# EAGLE schematic preparedinstruments_0_bechemel_v12 #MOTHERBOARD (EAGLE 9.6.2)
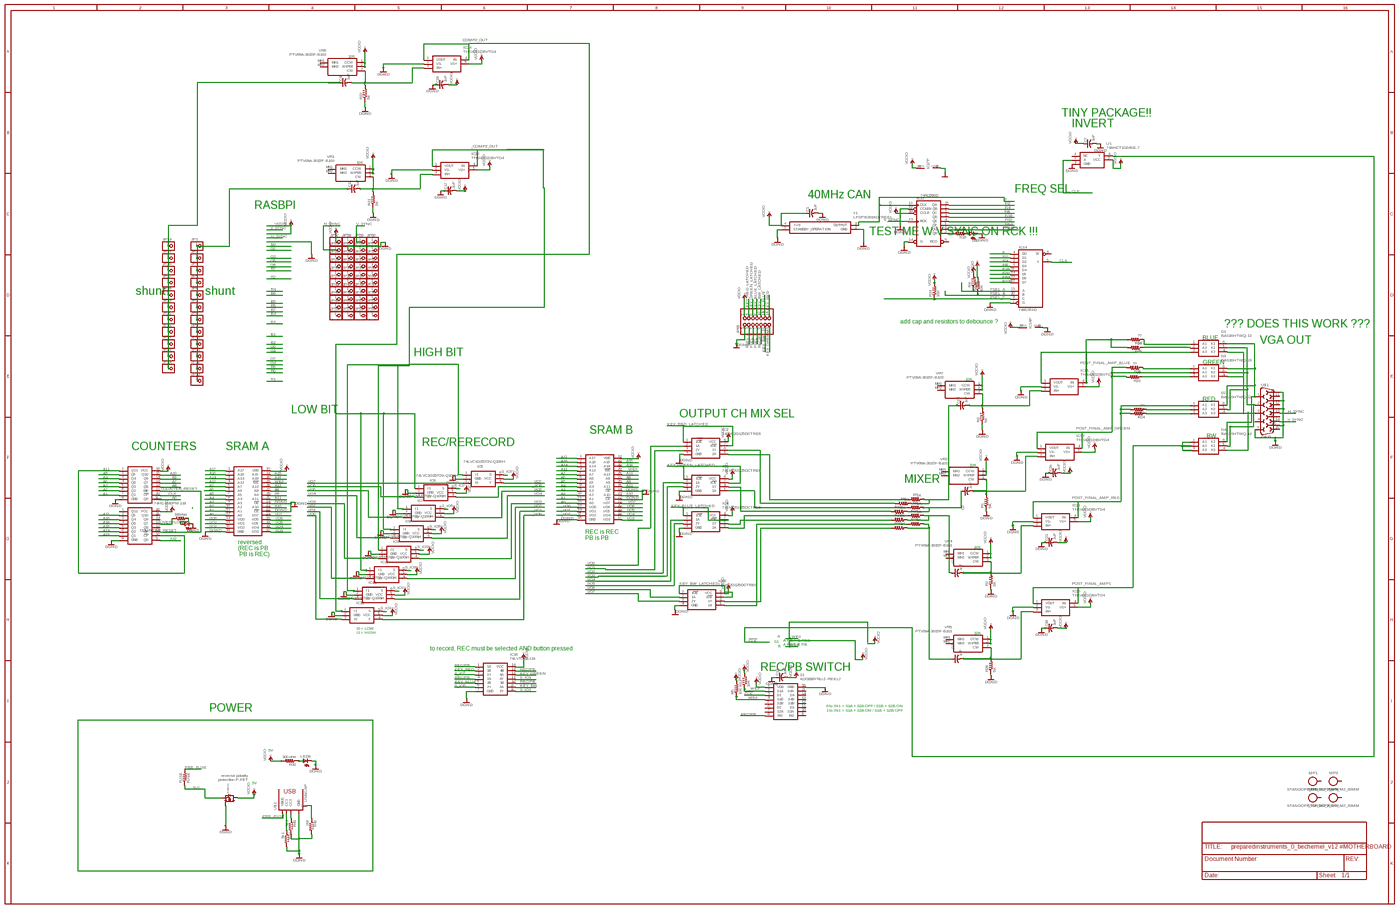
[diagram p0: schematic, sheet 1, overview]
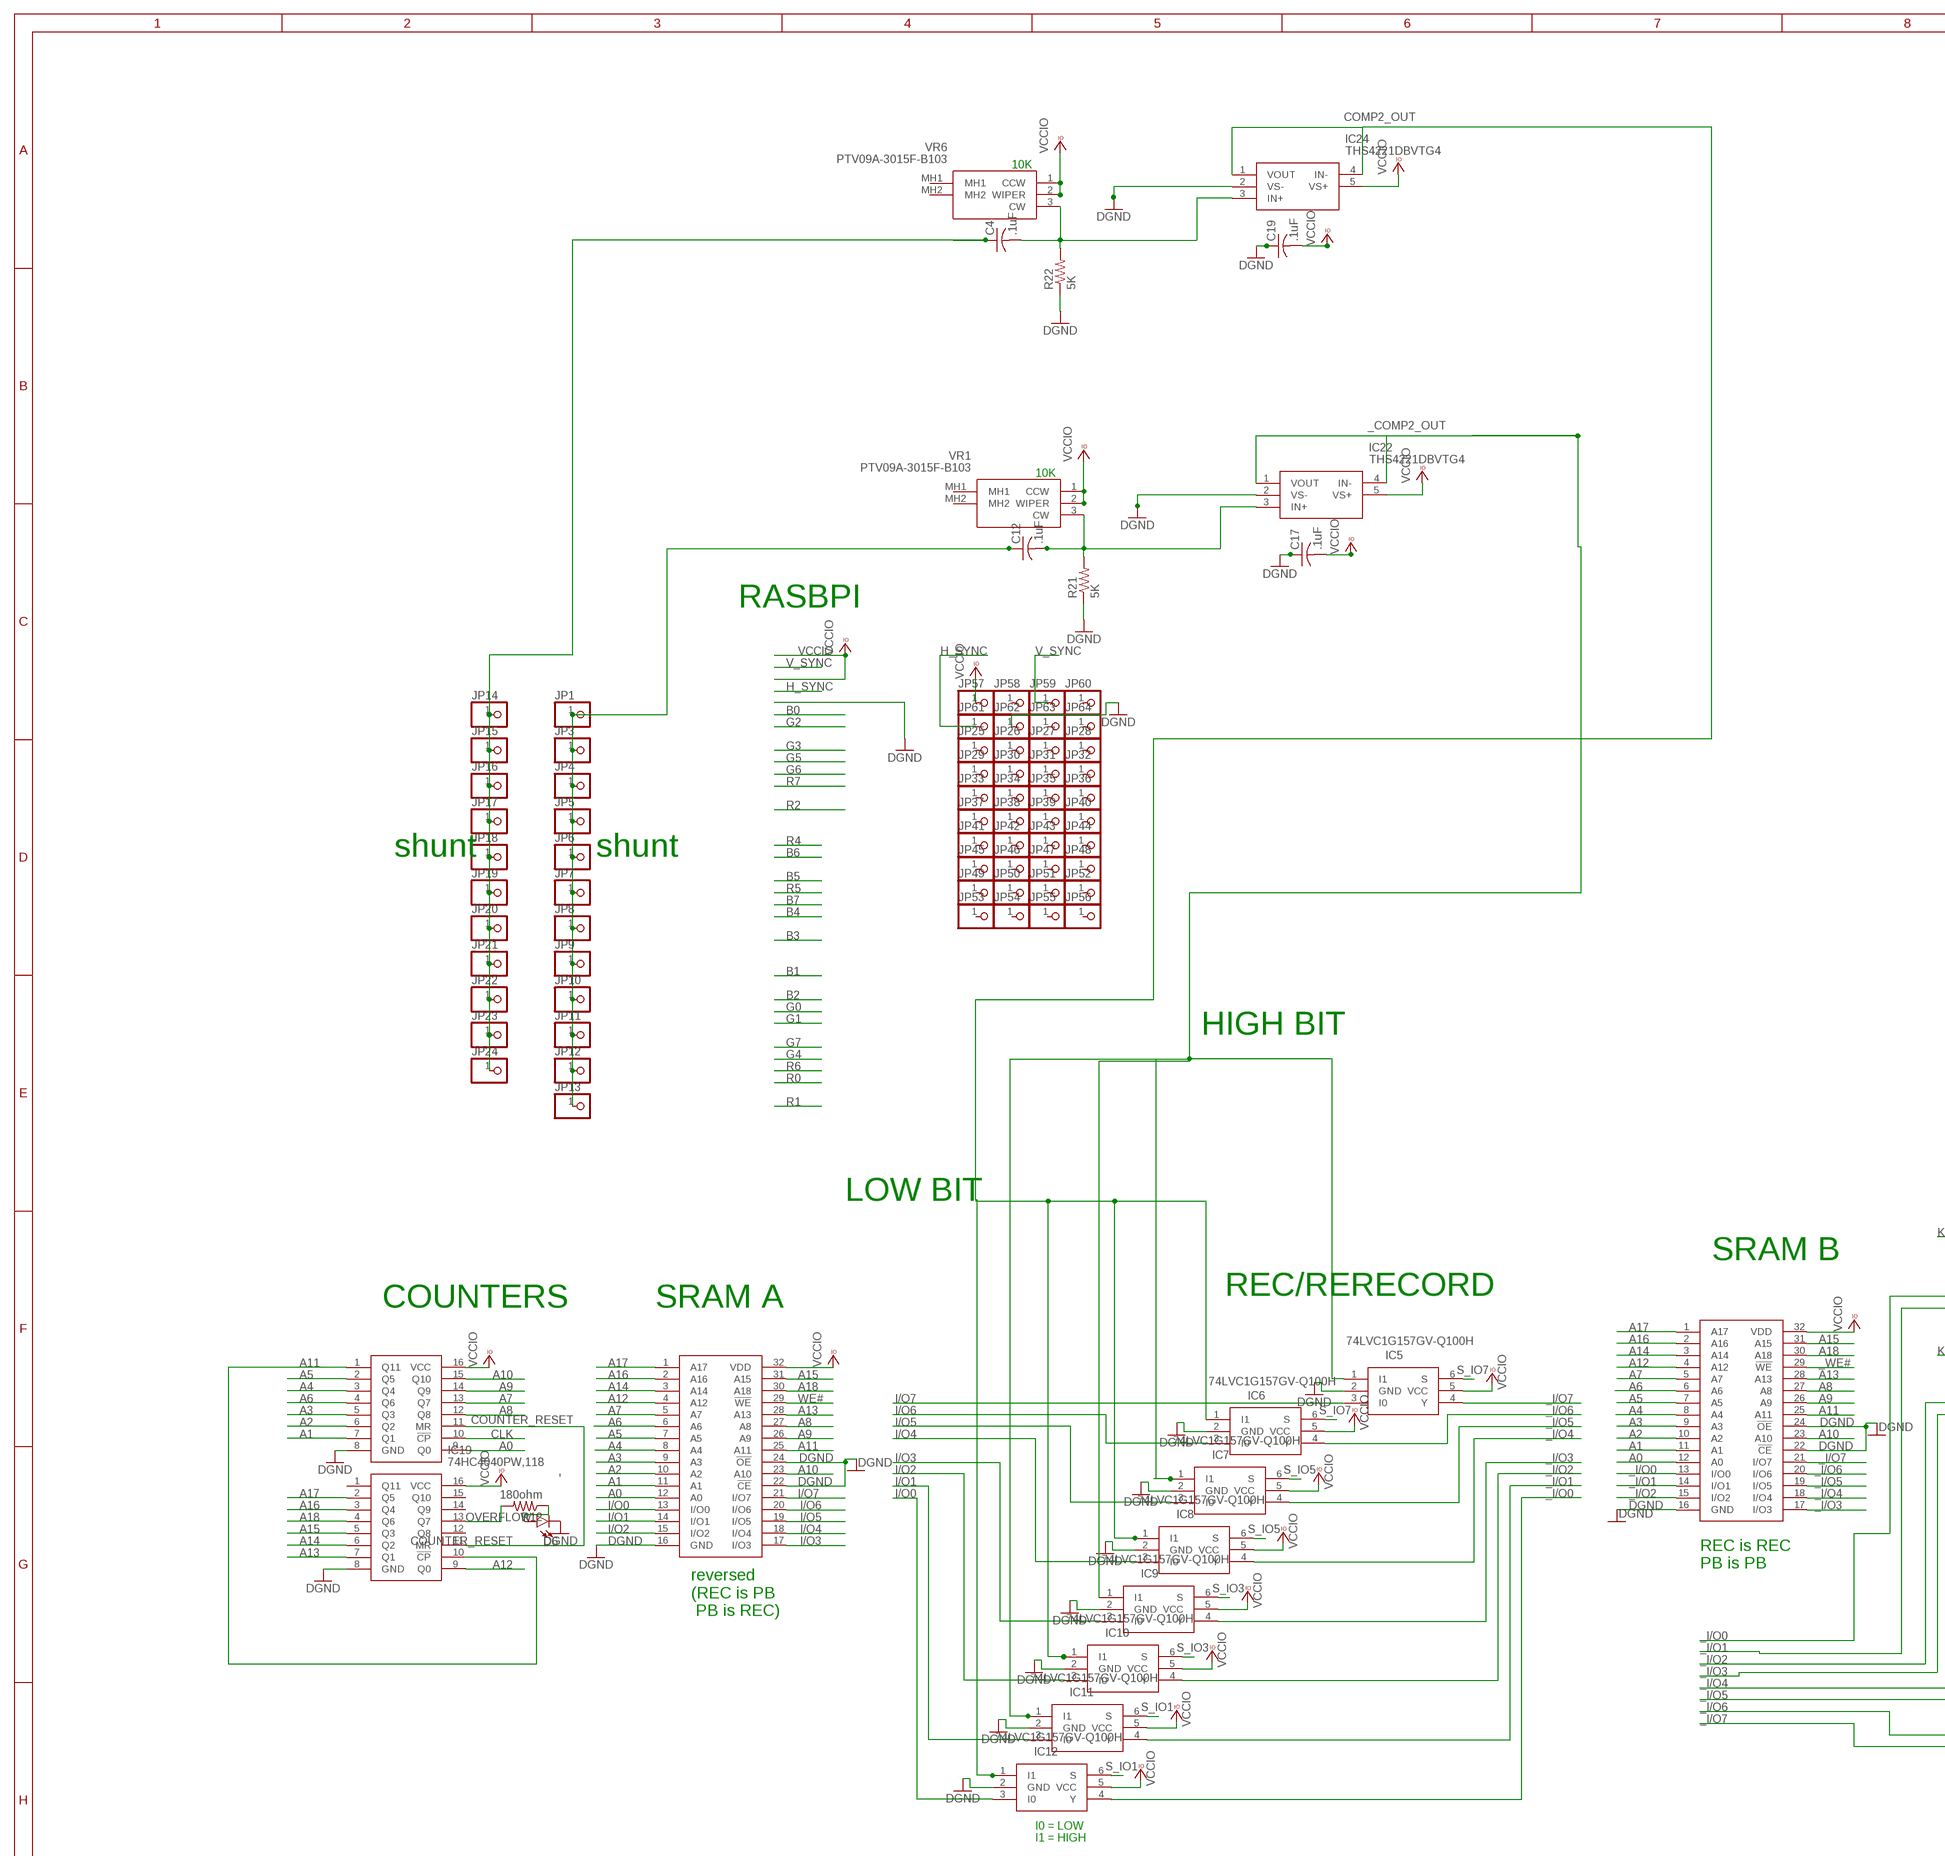
[diagram p1: schematic, sheet 1, part 1 of 4]
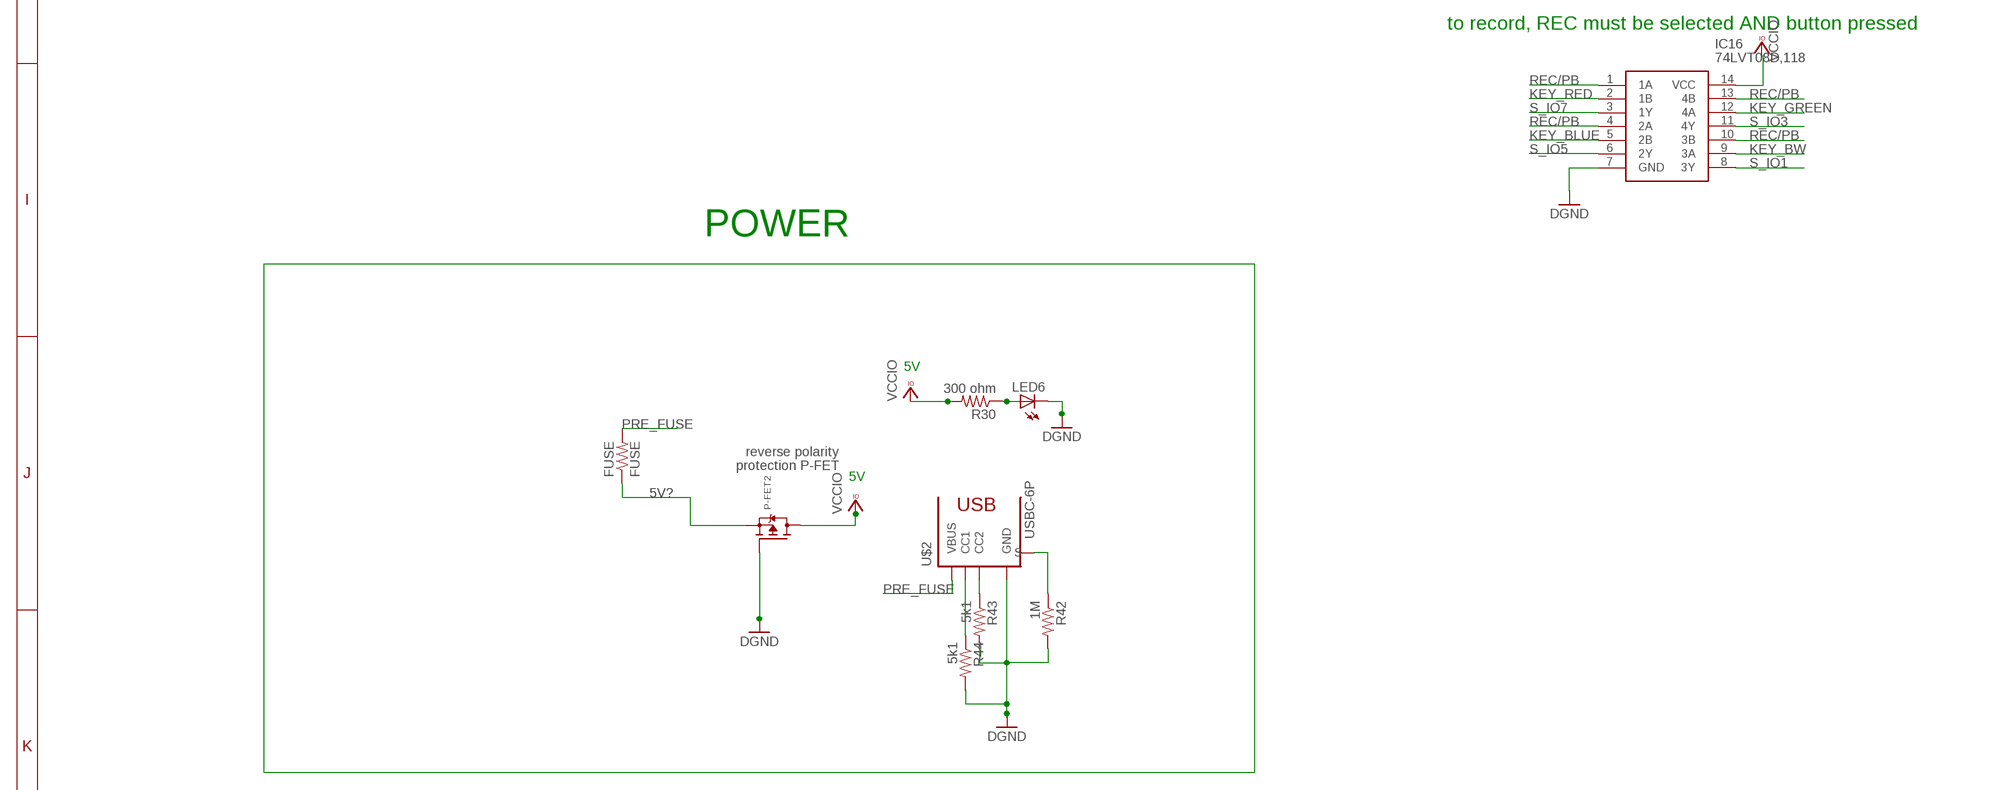
[diagram p2: schematic, sheet 1, part 2 of 4]
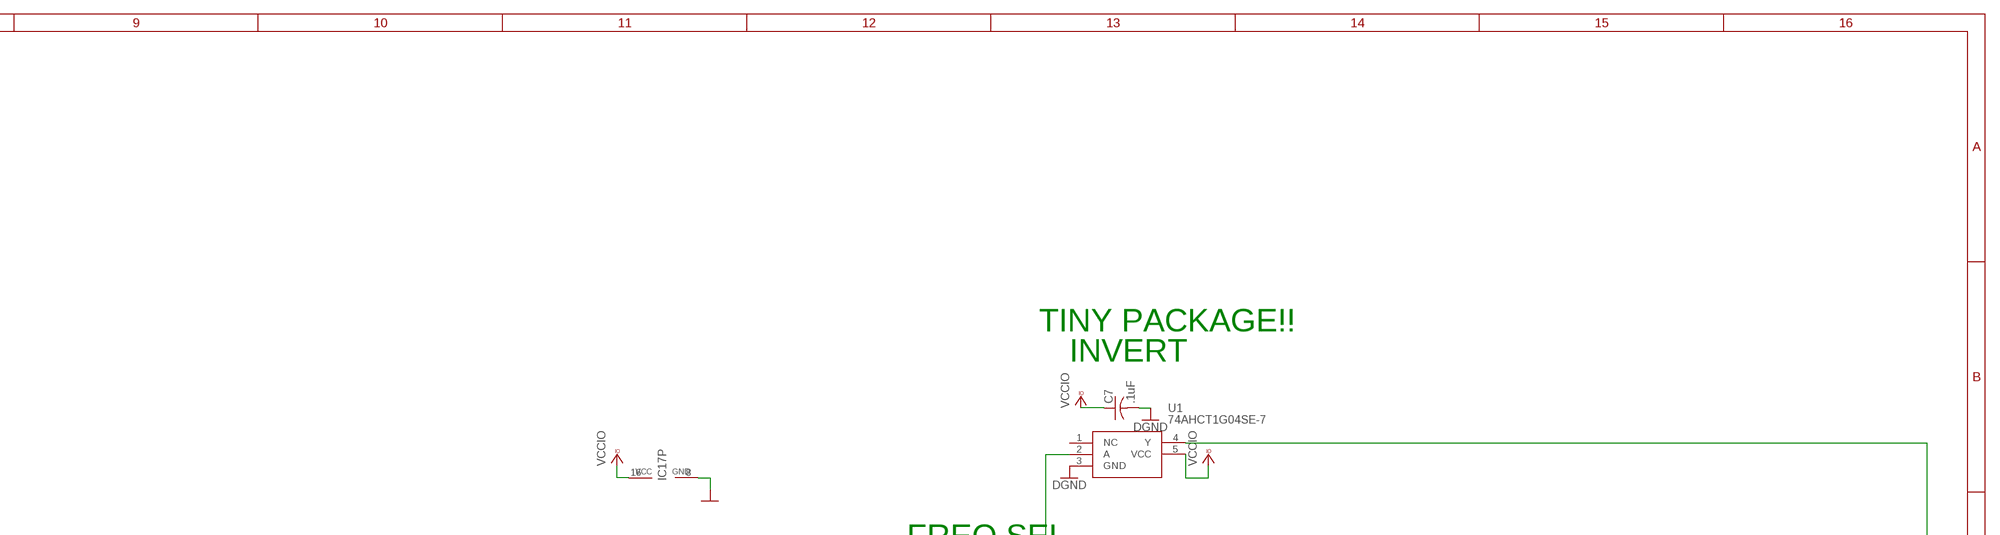
[diagram p3: schematic, sheet 1, part 3 of 4]
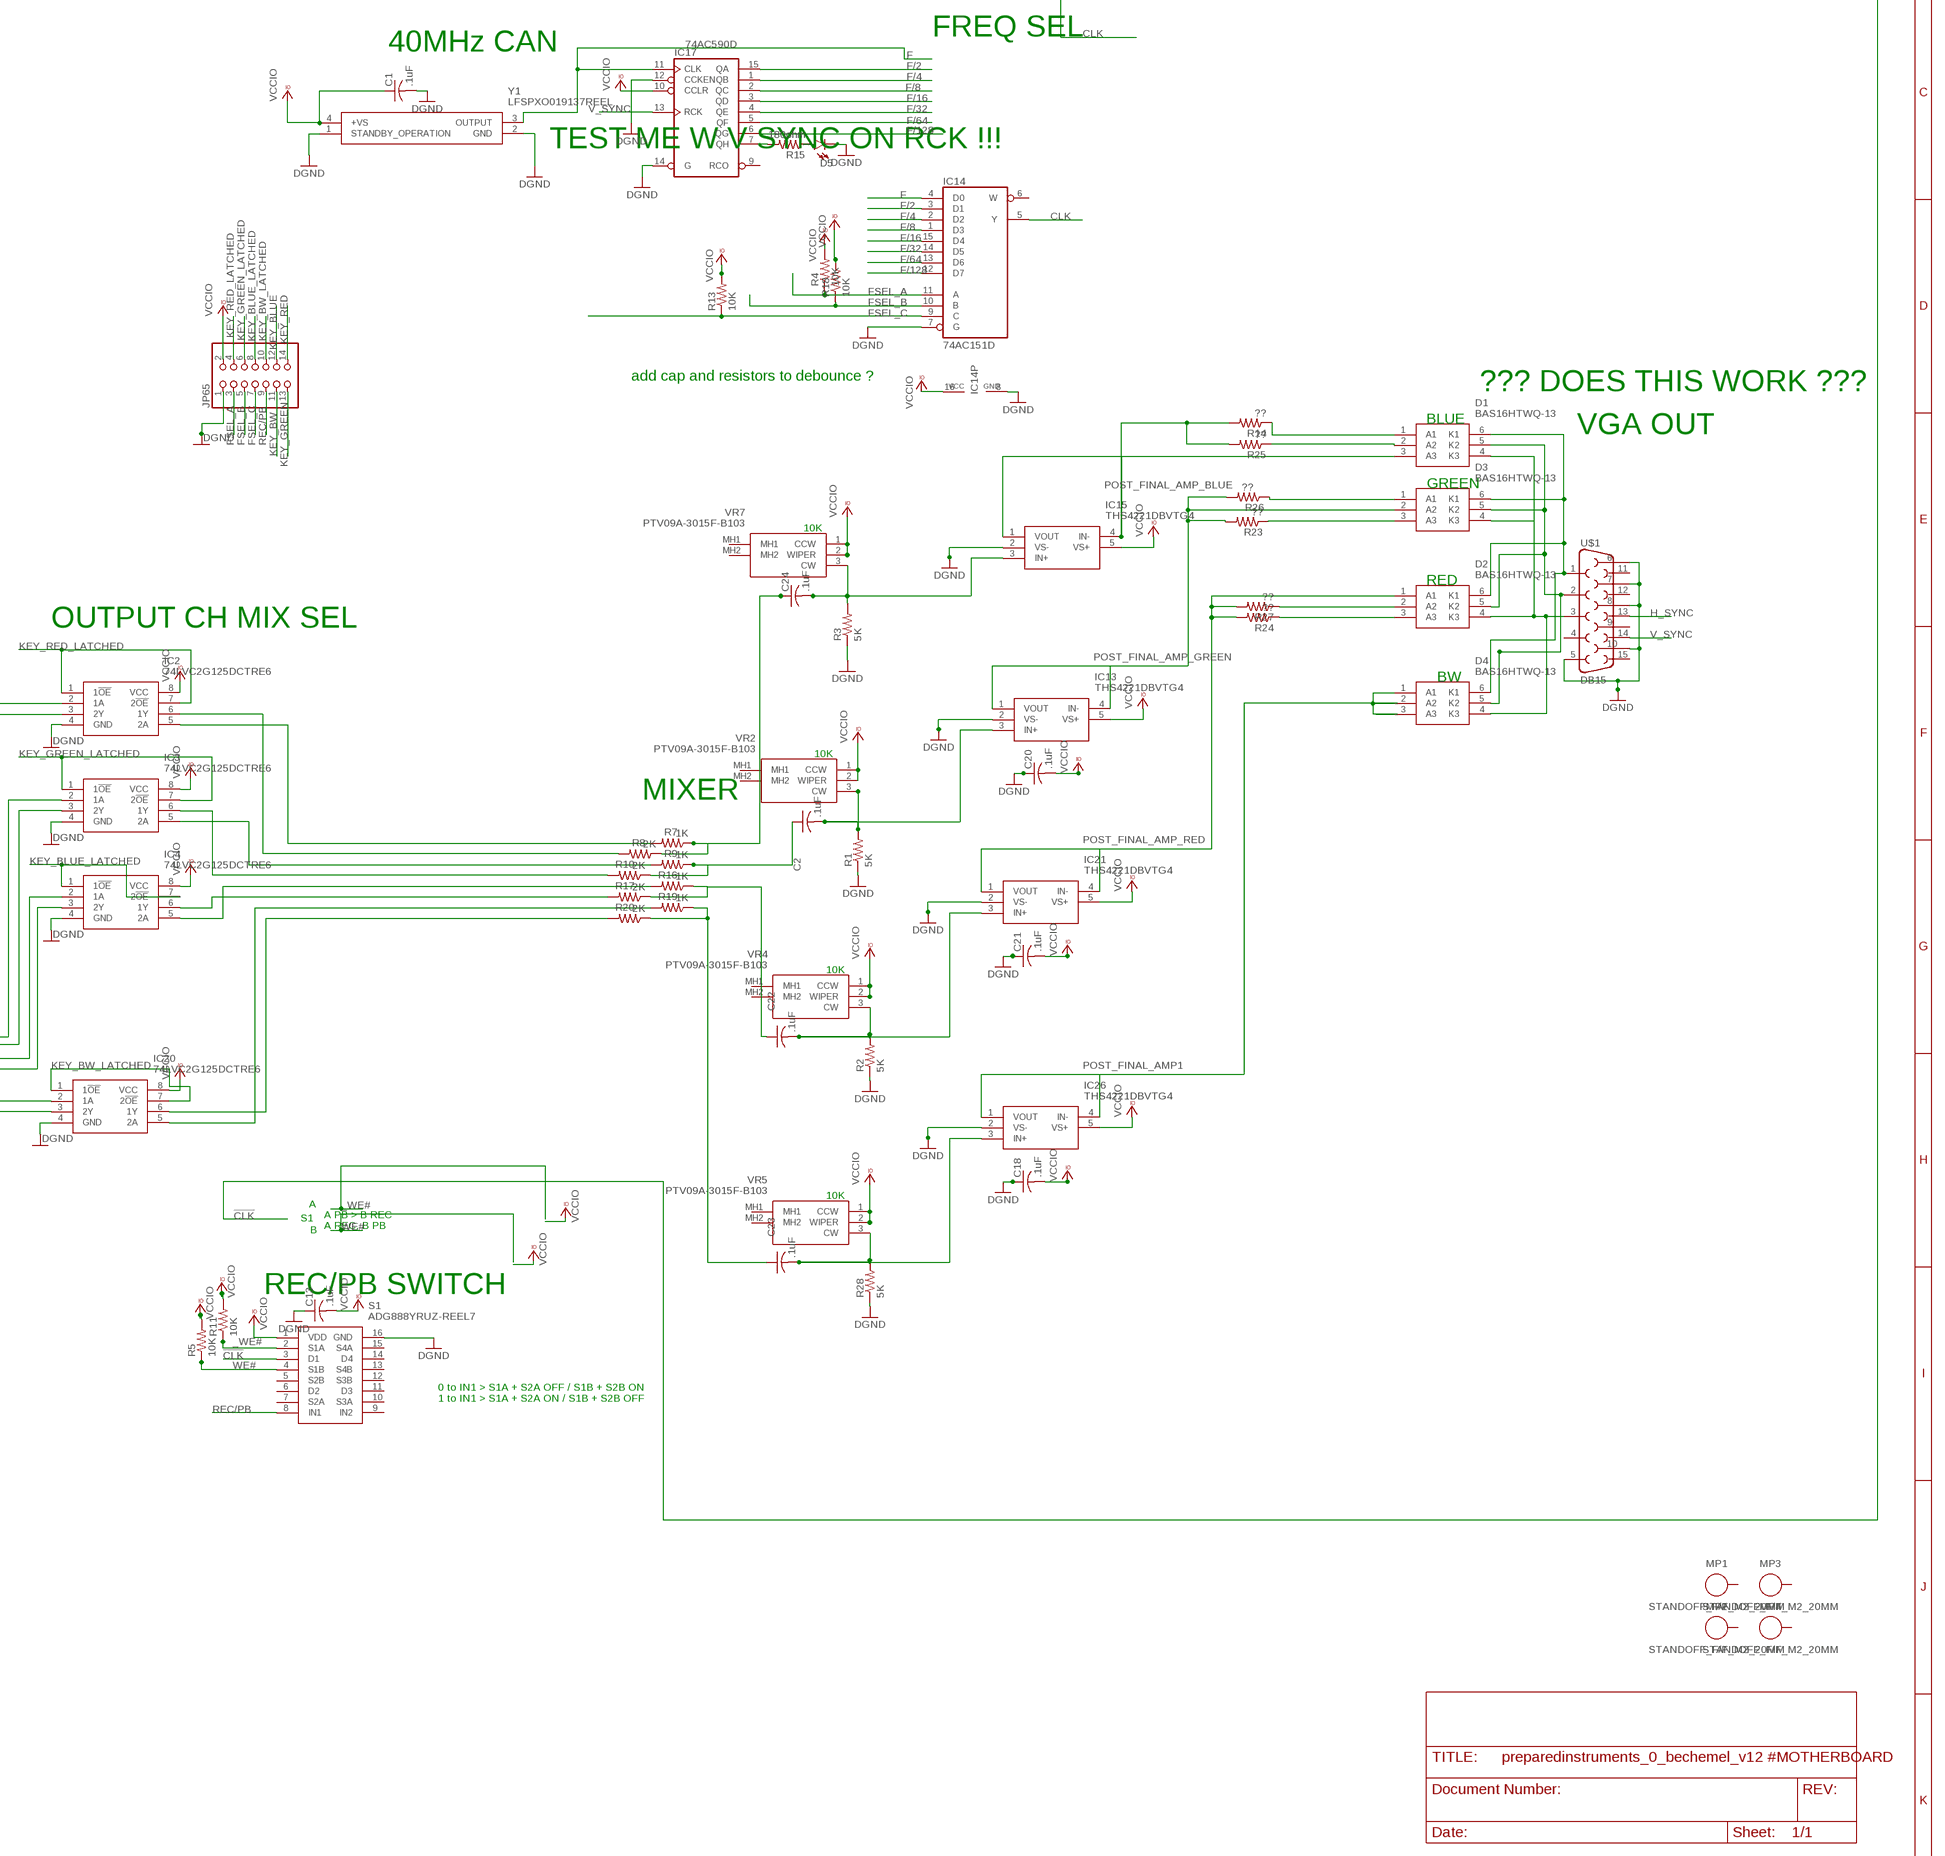
[diagram p4: schematic, sheet 1, part 4 of 4]

## Parts
C1  .1uF  C-USC0805  [C0805]
C2  .1uF  C-USC0805  [C0805]
C4  .1uF  C-USC0805  [C0805]
C7  .1uF  C-USC0805  [C0805]
C12  .1uF  C-USC0805  [C0805]
C13  .1uF  C-USC0805  [C0805]
C17  .1uF  C-USC0805  [C0805]
C18  .1uF  C-USC0805  [C0805]
C19  .1uF  C-USC0805  [C0805]
C20  .1uF  C-USC0805  [C0805]
C21  .1uF  C-USC0805  [C0805]
C22  .1uF  C-USC0805  [C0805]
C23  .1uF  C-USC0805  [C0805]
C24  .1uF  C-USC0805  [C0805]
D1  BAS16HTWQ-13  [SOT65P210X110-6N]
D2  BAS16HTWQ-13  [SOT65P210X110-6N]
D3  BAS16HTWQ-13  [SOT65P210X110-6N]
D4  BAS16HTWQ-13  [SOT65P210X110-6N]
D5  TIME  LED-RED1206  [LED-1206]
D6  TIME  LED-RED1206  [LED-1206]
FUSE  FUSE  R-US_R0805  [R0805]
IC1  IS61C5128AS-25QLI  [SOIC127P1412X305-32N]
IC2  74LVC2G125DCTRE6  [SOP65P400X130-8N]
IC3  74LVC2G125DCTRE6  [SOP65P400X130-8N]
IC4  74LVC2G125DCTRE6  [SOP65P400X130-8N]
IC5  74LVC1G157GV-Q100H  [SOT95P275X110-6N]
IC6  74LVC1G157GV-Q100H  [SOT95P275X110-6N]
IC7  74LVC1G157GV-Q100H  [SOT95P275X110-6N]
IC8  74LVC1G157GV-Q100H  [SOT95P275X110-6N]
IC9  74LVC1G157GV-Q100H  [SOT95P275X110-6N]
IC10  74LVC1G157GV-Q100H  [SOT95P275X110-6N]
IC11  74LVC1G157GV-Q100H  [SOT95P275X110-6N]
IC12  74LVC1G157GV-Q100H  [SOT95P275X110-6N]
IC13  THS4221DBVTG4  [SOT95P280X145-5N]
IC14  74AC151D  [SO16]
IC15  THS4221DBVTG4  [SOT95P280X145-5N]
IC16  74LVT08D,118  [74LVT08D118]
IC17  74AC590D  [SO16]
IC18  74HC4040PW,118  [SOP65P640X110-16N]
IC19  74HC4040PW,118  [SOP65P640X110-16N]
IC20  74LVC2G125DCTRE6  [SOP65P400X130-8N]
IC21  THS4221DBVTG4  [SOT95P280X145-5N]
IC22  THS4221DBVTG4  [SOT95P280X145-5N]
IC23  IS61C5128AS-25QLI  [SOIC127P1412X305-32N]
IC24  THS4221DBVTG4  [SOT95P280X145-5N]
IC26  THS4221DBVTG4  [SOT95P280X145-5N]
JP1  PINHD-1X1  [1X01]
JP3  PINHD-1X1  [1X01]
JP4  PINHD-1X1  [1X01]
JP5  PINHD-1X1  [1X01]
JP6  PINHD-1X1  [1X01]
JP7  PINHD-1X1  [1X01]
JP8  PINHD-1X1  [1X01]
JP9  PINHD-1X1  [1X01]
JP10  PINHD-1X1  [1X01]
JP11  PINHD-1X1  [1X01]
JP12  PINHD-1X1  [1X01]
JP13  PINHD-1X1  [1X01]
JP14  PINHD-1X1  [1X01]
JP15  PINHD-1X1  [1X01]
JP16  PINHD-1X1  [1X01]
JP17  PINHD-1X1  [1X01]
JP18  PINHD-1X1  [1X01]
JP19  PINHD-1X1  [1X01]
JP20  PINHD-1X1  [1X01]
JP21  PINHD-1X1  [1X01]
JP22  PINHD-1X1  [1X01]
JP23  PINHD-1X1  [1X01]
JP24  PINHD-1X1  [1X01]
JP25  PINHD-1X1  [1X01]
JP26  PINHD-1X1  [1X01]
JP27  PINHD-1X1  [1X01]
JP28  PINHD-1X1  [1X01]
JP29  PINHD-1X1  [1X01]
JP30  PINHD-1X1  [1X01]
JP31  PINHD-1X1  [1X01]
JP32  PINHD-1X1  [1X01]
JP33  PINHD-1X1  [1X01]
JP34  PINHD-1X1  [1X01]
JP35  PINHD-1X1  [1X01]
JP36  PINHD-1X1  [1X01]
JP37  PINHD-1X1  [1X01]
JP38  PINHD-1X1  [1X01]
JP39  PINHD-1X1  [1X01]
JP40  PINHD-1X1  [1X01]
JP41  PINHD-1X1  [1X01]
JP42  PINHD-1X1  [1X01]
JP43  PINHD-1X1  [1X01]
JP44  PINHD-1X1  [1X01]
JP45  PINHD-1X1  [1X01]
JP46  PINHD-1X1  [1X01]
JP47  PINHD-1X1  [1X01]
JP48  PINHD-1X1  [1X01]
JP49  PINHD-1X1  [1X01]
JP50  PINHD-1X1  [1X01]
JP51  PINHD-1X1  [1X01]
JP52  PINHD-1X1  [1X01]
JP53  PINHD-1X1  [1X01]
JP54  PINHD-1X1  [1X01]
JP55  PINHD-1X1  [1X01]
JP56  PINHD-1X1  [1X01]
JP57  PINHD-1X1  [1X01]
JP58  PINHD-1X1  [1X01]
JP59  PINHD-1X1  [1X01]
JP60  PINHD-1X1  [1X01]
JP61  PINHD-1X1  [1X01]
JP62  PINHD-1X1  [1X01]
JP63  PINHD-1X1  [1X01]
JP64  PINHD-1X1  [1X01]
JP65  PINHD-2X7  [2X07]
LED6  LEDCHIPLED_0805  [CHIPLED_0805]
MP1  STANDOFF_F/F_M2_20MM  [STANDOFF_HEX_FEMALE_400X2000_M2X0.4_MTGP600H220]
MP2  STANDOFF_F/F_M2_20MM  [STANDOFF_HEX_FEMALE_400X2000_M2X0.4_MTGP600H220]
MP3  STANDOFF_F/F_M2_20MM  [STANDOFF_HEX_FEMALE_400X2000_M2X0.4_MTGP600H220]
MP4  STANDOFF_F/F_M2_20MM  [STANDOFF_HEX_FEMALE_400X2000_M2X0.4_MTGP600H220]
P-FET2  MOSFET-PWIDE  [SOT23-WIDE]
R1  5K  R-US_R0805  [R0805]
R2  5K  R-US_R0805  [R0805]
R3  5K  R-US_R0805  [R0805]
R4  10K  R-US_R0805  [R0805]
R5  10K  R-US_R0805  [R0805]
R7  1K  R-US_R0805  [R0805]
R8  2K  R-US_R0805  [R0805]
R9  1K  R-US_R0805  [R0805]
R10  2K  R-US_R0805  [R0805]
R11  10K  R-US_R0805  [R0805]
R12  180ohm  R-US_R0805  [R0805]
R13  10K  R-US_R0805  [R0805]
R14  ??  R-US_R0805  [R0805]
R15  180ohm  R-US_R0805  [R0805]
R16  1K  R-US_R0805  [R0805]
R17  2K  R-US_R0805  [R0805]
R18  10K  R-US_R0805  [R0805]
R19  1K  R-US_R0805  [R0805]
R20  2K  R-US_R0805  [R0805]
R21  5K  R-US_R0805  [R0805]
R22  5K  R-US_R0805  [R0805]
R23  ??  R-US_R0805  [R0805]
R24  ??  R-US_R0805  [R0805]
R25  ??  R-US_R0805  [R0805]
R26  ??  R-US_R0805  [R0805]
R27  ??  R-US_R0805  [R0805]
R28  5K  R-US_R0805  [R0805]
R30  300 ohm  R-US_R0805  [R0805]
R42  1M  R-US_R0805  [R0805]
R43  5k1  R-US_R0805  [R0805]
R44  5k1  R-US_R0805  [R0805]
S1  ADG888YRUZ-REEL7  [SOP65P640X120-16N]
U1  74AHCT1G04SE-7  [SOT65P210X110-5N]
U$1  DB15  [DB15]
U$2  USBC-6P  [USCX-06FX-XXMX-01]
VR1  PTV09A-3015F-B103  [PTV09A3015FB103]
VR2  PTV09A-3015F-B103  [PTV09A3015FB103]
VR4  PTV09A-3015F-B103  [PTV09A3015FB103]
VR5  PTV09A-3015F-B103  [PTV09A3015FB103]
VR6  PTV09A-3015F-B103  [PTV09A3015FB103]
VR7  PTV09A-3015F-B103  [PTV09A3015FB103]
Y1  LFSPXO019137REEL  [LFSPXO019137REEL]

## Nets
5V?: FUSE.1 P-FET2.2(S)
!CLK: S1.3(D1) U1.4(Y)
_COMP2_OUT: IC5.1(I1) IC7.1(I1) IC9.1(I1) IC11.1(I1) IC22.1(VOUT) IC22.4(IN-)
_I/O0: IC1.13(I/O0) IC2.2(1A) IC12.4(Y)
_I/O1: IC1.14(I/O1) IC2.3(2Y) IC11.4(Y)
_I/O2: IC1.15(I/O2) IC3.2(1A) IC10.4(Y)
_I/O3: IC1.17(I/O3) IC3.3(2Y) IC9.4(Y)
_I/O4: IC1.18(I/O4) IC4.2(1A) IC8.4(Y)
_I/O5: IC1.19(I/O5) IC4.3(2Y) IC7.4(Y)
_I/O6: IC1.20(I/O6) IC6.4(Y) IC20.2(1A)
_I/O7: IC1.21(I/O7) IC5.4(Y) IC20.3(2Y)
_WE#: IC1.29(!WE) R11.1 S1.2(S1A)
A0: IC1.12(A0) IC18.9(Q0) IC23.12(A0)
A1: IC1.11(A1) IC18.7(Q1) IC23.11(A1)
A2: IC1.10(A2) IC18.6(Q2) IC23.10(A2)
A3: IC1.9(A3) IC18.5(Q3) IC23.9(A3)
A4: IC1.8(A4) IC18.3(Q4) IC23.8(A4)
A5: IC1.7(A5) IC18.2(Q5) IC23.7(A5)
A6: IC1.6(A6) IC18.4(Q6) IC23.6(A6)
A7: IC1.5(A7) IC18.13(Q7) IC23.5(A7)
A8: IC1.27(A8) IC18.12(Q8) IC23.27(A8)
A9: IC1.26(A9) IC18.14(Q9) IC23.26(A9)
A10: IC1.23(A10) IC18.15(Q10) IC23.23(A10)
A11: IC1.25(A11) IC18.1(Q11) IC19.10(!CP) IC23.25(A11)
A12: IC1.4(A12) IC19.9(Q0) IC23.4(A12)
A13: IC1.28(A13) IC19.7(Q1) IC23.28(A13)
A14: IC1.3(A14) IC19.6(Q2) IC23.3(A14)
A15: IC1.31(A15) IC19.5(Q3) IC23.31(A15)
A16: IC1.2(A16) IC19.3(Q4) IC23.2(A16)
A17: IC1.1(A17) IC19.2(Q5) IC23.1(A17)
A18: IC1.30(A18) IC19.4(Q6) IC23.30(A18)
CLK: IC14.5(Y) IC18.10(!CP) U1.2(A)
COMP2_OUT: IC6.1(I1) IC8.1(I1) IC10.1(I1) IC12.1(I1) IC24.1(VOUT) IC24.4(IN-)
COUNTER_RESET: IC18.11(MR) IC19.11(MR)
DGND: C1.2 C7.2 C13.1 C17.1 C18.1 C19.1 C20.1 C21.1 D5.C D6.C IC1.16(GND) IC1.22(!CE) IC1.24(!OE) IC2.4(GND) IC3.4(GND) IC4.4(GND) IC5.2(GND) IC6.2(GND) IC7.2(GND) IC8.2(GND) IC9.2(GND) IC10.2(GND) IC11.2(GND) IC12.2(GND) IC13.2(VS-) IC14.7(G) IC14.8(GND) IC15.2(VS-) IC16.7(GND) IC17.8(GND) IC17.12(CCKEN) IC17.14(G) IC18.8(GND) IC19.8(GND) IC20.4(GND) IC21.2(VS-) IC22.2(VS-) IC23.16(GND) IC23.22(!CE) IC23.24(!OE) IC24.2(VS-) IC26.2(VS-) JP62.1 JP65.1 LED6.C P-FET2.1(G) R1.1 R2.1 R3.1 R21.1 R22.1 R28.1 R42.2 R43.2 R44.2 S1.16(GND) U1.3(GND) U$1.5 U$1.6 U$1.7 U$1.8 U$1.10 U$2.GND1(GND) U$2.GND2(GND) Y1.1(STANDBY_OPERATION) Y1.2(GND)
F: IC14.4(D0) IC17.11(CLK) Y1.3(OUTPUT)
F/2: IC14.3(D1) IC17.15(QA)
F/4: IC14.2(D2) IC17.1(QB)
F/8: IC14.1(D3) IC17.2(QC)
F/16: IC14.15(D4) IC17.3(QD)
F/32: IC14.14(D5) IC17.4(QE)
F/64: IC14.13(D6) IC17.5(QF)
F/128: IC14.12(D7) IC17.6(QG)
FSEL_A: IC14.11(A) JP65.3 R4.1
FSEL_B: IC14.10(B) JP65.5 R18.1
FSEL_C: IC14.9(C) JP65.7 R13.1
H_SYNC: JP61.1 U$1.13
I/O0: IC12.3(I0) IC23.13(I/O0)
I/O1: IC11.3(I0) IC23.14(I/O1)
I/O2: IC10.3(I0) IC23.15(I/O2)
I/O3: IC9.3(I0) IC23.17(I/O3)
I/O4: IC8.3(I0) IC23.18(I/O4)
I/O5: IC7.3(I0) IC23.19(I/O5)
I/O6: IC6.3(I0) IC23.20(I/O6)
I/O7: IC5.3(I0) IC23.21(I/O7)
INT_IN1: C24.2 IC15.3(IN+) R3.2 VR7.3(CW)
INT_IN2: C12.2 IC22.3(IN+) R21.2 VR1.3(CW)
INT_IN3: C4.2 IC24.3(IN+) R22.2 VR6.3(CW)
INT_IN4: C22.2 IC21.3(IN+) R2.2 VR4.3(CW)
INT_IN5: C23.2 IC26.3(IN+) R28.2 VR5.3(CW)
INT_IN6: C2.2 IC13.3(IN+) R1.2 VR2.3(CW)
KEY_BLUE: IC16.5(2B) JP65.12
KEY_BLUE_LATCHED: IC4.1(1!OE) IC4.7(2!OE) JP65.8
KEY_BW: IC16.9(3A) JP65.11
KEY_BW_LATCHED: IC20.1(1!OE) IC20.7(2!OE) JP65.10
KEY_GREEN: IC16.12(4A) JP65.13
KEY_GREEN_LATCHED: IC3.1(1!OE) IC3.7(2!OE) JP65.6
KEY_RED: IC16.2(1B) JP65.14
KEY_RED_LATCHED: IC2.1(1!OE) IC2.7(2!OE) JP65.4
N$1: D5.A R15.1
N$3: C12.1 JP1.1 JP3.1 JP4.1 JP5.1 JP6.1 JP7.1 JP8.1 JP9.1 JP10.1 JP11.1 JP12.1 JP13.1
N$4: D6.A R12.1
N$5: IC17.7(QH) R15.2
N$7: IC4.5(2A) R16.2
N$9: LED6.A R30.1
N$10: IC4.6(1Y) R17.2
N$13: R43.1 U$2.CC2
N$17: IC20.5(2A) R19.2
N$18: R42.1 U$2.SHIELD1(S) U$2.SHIELD2(S) U$2.SHIELD3(S) U$2.SHIELD4(S)
N$20: IC20.6(1Y) R20.2
N$21: R44.1 U$2.CC1
N$24: IC2.5(2A) R7.2
N$25: IC2.6(1Y) R8.2
N$26: IC3.5(2A) R9.2
N$27: IC3.6(1Y) R10.2
N$28: C4.1 JP14.1 JP15.1 JP16.1 JP17.1 JP18.1 JP19.1 JP20.1 JP21.1 JP22.1 JP23.1 JP24.1
N$31: C24.1 R7.1 R8.1
N$32: C22.1 R16.1 R17.1
N$33: C2.1 R9.1 R10.1
N$34: C23.1 R19.1 R20.1
N$35: D3.1(A1) R26.1
N$36: D1.1(A1) R14.1
N$37: D1.2(A2) R25.1
N$38: D2.3(A3) R24.1
N$39: D1.6(K1) D2.6(K1) D3.6(K1) D4.6(K1) U$1.1
N$41: D2.2(A2) R27.1
N$42: D3.3(A3) R23.1
N$43: D1.5(K2) D2.5(K2) D3.5(K2) D4.5(K2) U$1.2
N$44: D1.4(K3) D2.4(K3) D3.4(K3) D4.4(K3) U$1.3
OVERFLOW: IC19.13(Q7) R12.2
POST_FINAL_AMP1: D4.1(A1) D4.2(A2) D4.3(A3) IC26.1(VOUT) IC26.4(IN-)
POST_FINAL_AMP_BLUE: D1.3(A3) IC15.1(VOUT) IC15.4(IN-) R14.2 R25.2
POST_FINAL_AMP_GREEN: D3.2(A2) IC13.1(VOUT) IC13.4(IN-) R23.2 R26.2
POST_FINAL_AMP_RED: D2.1(A1) IC21.1(VOUT) IC21.4(IN-) R24.2 R27.2
PRE_FUSE: FUSE.2 U$2.VBUS1(VBUS) U$2.VBUS2(VBUS)
REC/PB: IC16.1(1A) IC16.4(2A) IC16.10(3B) IC16.13(4B) JP65.9 S1.8(IN1)
S_IO1: IC11.6(S) IC12.6(S) IC16.8(3Y)
S_IO3: IC9.6(S) IC10.6(S) IC16.11(4Y)
S_IO5: IC7.6(S) IC8.6(S) IC16.6(2Y)
S_IO7: IC5.6(S) IC6.6(S) IC16.3(1Y)
V_SYNC: IC17.13(RCK) JP59.1 U$1.14
VCCIO: C1.1 C7.1 C13.2 C17.2 C18.2 C19.2 C20.2 C21.2 IC1.32(VDD) IC2.8(VCC) IC3.8(VCC) IC4.8(VCC) IC5.5(VCC) IC6.5(VCC) IC7.5(VCC) IC8.5(VCC) IC9.5(VCC) IC10.5(VCC) IC11.5(VCC) IC12.5(VCC) IC13.5(VS+) IC14.16(VCC) IC15.5(VS+) IC16.14(VCC) IC17.10(CCLR) IC17.16(VCC) IC18.16(VCC) IC19.16(VCC) IC20.8(VCC) IC21.5(VS+) IC22.5(VS+) IC23.32(VDD) IC24.5(VS+) IC26.5(VS+) JP57.1 JP65.2 P-FET2.3(D) R4.2 R5.2 R11.2 R13.2 R18.2 R30.2 S1.1(VDD) U1.5(VCC) VR1.1(CCW) VR1.2(WIPER) VR2.1(CCW) VR2.2(WIPER) VR4.1(CCW) VR4.2(WIPER) VR5.1(CCW) VR5.2(WIPER) VR6.1(CCW) VR6.2(WIPER) VR7.1(CCW) VR7.2(WIPER) Y1.4(+VS)
WE#: IC23.29(!WE) R5.1 S1.4(S1B)
Unconnected: IC14.6(W) IC17.9(RCO) IC19.1(Q11) IC19.12(Q8) IC19.14(Q9) IC19.15(Q10) JP25.1 JP26.1 JP27.1 JP28.1 JP29.1 JP30.1 JP31.1 JP32.1 JP33.1 JP34.1 JP35.1 JP36.1 JP37.1 JP38.1 JP39.1 JP40.1 JP41.1 JP42.1 JP43.1 JP44.1 JP45.1 JP46.1 JP47.1 JP48.1 JP49.1 JP50.1 JP51.1 JP52.1 JP53.1 JP54.1 JP55.1 JP56.1 JP58.1 JP60.1 JP63.1 JP64.1 MP1.1 MP2.1 MP3.1 MP4.1 S1.5(S2B) S1.6(D2) S1.7(S2A) S1.9(IN2) S1.10(S3A) S1.11(D3) S1.12(S3B) S1.13(S4B) S1.14(D4) S1.15(S4A) U1.1(NC) U$1.4 U$1.9 U$1.11 U$1.12 U$1.15 VR1.MH1 VR1.MH2 VR2.MH1 VR2.MH2 VR4.MH1 VR4.MH2 VR5.MH1 VR5.MH2 VR6.MH1 VR6.MH2 VR7.MH1 VR7.MH2

## Notes on the sheet
- 10K
- TINY PACKAGE!!
- INVERT
- 10K
- FREQ SEL
- 40MHz CAN
- RASBPI
- TEST ME W V SYNC ON RCK !!!
- shunt | shunt
- ??? DOES THIS WORK ???
- add cap and resistors to debounce ?
- BLUE
- VGA OUT
- HIGH BIT
- GREEN
- 10K
- RED
- LOW BIT
- OUTPUT CH MIX SEL
- SRAM B
- BW
- REC/RERECORD
- COUNTERS | SRAM A
- 10K
- MIXER
- REC is REC 
  PB is PB
- 10K
- reversed 
  (REC is PB 
   PB is REC)
- I0 = LOW
- I1 = HIGH | 10K
- A
- A PB > B REC
- S1
- A REC, B PB
- B
- to record, REC must be selected AND button pressed
- REC/PB SWITCH
- POWER
- 0 to IN1 > S1A + S2A OFF / S1B + S2B ON
  1 to IN1 > S1A + S2A ON / S1B + S2B OFF
- 5V
- reverse polarity
- protection P-FET
- 5V

## Library data of the parts
C1 C2 C4 C7 C12 C13 C17-C24 = adafruit:C-US: CAPACITOR, American symbol
D1-D4 = BAS16HTWQ-13:BAS16HTWQ-13: Diodes - General Purpose, Power, Switching Fast Switching Diode Array 100Vrm 75Vrrm Source: Datasheet <https://componentsearchengine.com/Datasheets/1/BAS16HTWQ-13.pdf>; DESCRIPTION: Diodes - General Purpose, Power, Switching Fast Switching Diode Array 100Vrm 75Vrrm; HEIGHT: 1.1mm; MANUFACTURER_NAME: Diodes Incorporated; MANUFACTURER_PART_NUMBER: BAS16HTWQ-13; MOUSER_PART_NUMBER: 621-BAS16HTWQ-13; MOUSER_PRICE-STOCK: https://www.mouser.com/Search/Refine.aspx?Keyword=621-BAS16HTWQ-13
D5 D6 = SparkFun-LED:LED-RED: Red SMD LED Used in manufacturing of most products at SparkFun Packages: 0603 - SMD 0603 package [Product Link] <http://docs.avagotech.com/docs/AV02-0551EN> 0603 SMART - SMD 0603 SMART package ( more efficient and expensive)[Product Link] <http://www.osram-os.com/Graphics/XPic2/00077099_0.pdf> 1206 - SMD1206 package [Product Link] <https://www.sparkfun.com/datasheets/DevTools/LilyPad/Q150OVS4.pdff> SparkFun Products: Pro Mini 328 -5V <https://www.sparkfun.com/products/821> RedBoard <https://www.sparkfun.com/products/12757> IOIO-OTG <https://www.sparkfun.com/products/13613>; PROD_ID: DIO-09912; VALUE: RED
FUSE R1-R5 R7-R28 R30 R42-R44 = adafruit:R-US_: RESISTOR, American symbol
IC1 IC23 = IS61C5128AS-25QLI:IS61C5128AS-25QLI: SRAM 4Mb,High-Speed,Low Power,Async,512K x 8,25ns,5v,32 Pin SOP (450 mil), RoHS Source: Datasheet <http://www.issi.com/WW/pdf/61-64C5128AL.pdf>; DESCRIPTION: SRAM 4Mb,High-Speed,Low Power,Async,512K x 8,25ns,5v,32 Pin SOP (450 mil), RoHS; HEIGHT: 3.05mm; MANUFACTURER_NAME: Integrated Silicon Solution Inc.; MANUFACTURER_PART_NUMBER: IS61C5128AS-25QLI; MOUSER_PART_NUMBER: 870-61C5128AS-25QLI; MOUSER_PRICE-STOCK: https://www.mouser.co.uk/ProductDetail/ISSI/IS61C5128AS-25QLI/?qs=v9o34zvNDAYPCnMwiEH0%252BA%3D%3D
IC2-IC4 IC20 = 74LVC2G125DCTRE6:74LVC2G125DCTRE6: Dual Bus Buffer Gate with 3-State Outputs Source: Datasheet <http://www.ti.com/lit/gpn/SN74LVC2G125>; DESCRIPTION: Dual Bus Buffer Gate with 3-State Outputs; HEIGHT: 1.3mm; MANUFACTURER_NAME: Texas Instruments; MANUFACTURER_PART_NUMBER: 74LVC2G125DCTRE6; MOUSER_PART_NUMBER: 595-74LVC2G125DCTRE6; MOUSER_PRICE-STOCK: https://www.mouser.co.uk/ProductDetail/Texas-Instruments/74LVC2G125DCTRE6?qs=pajgIaoyDUj1KrgrtPlMIQ%3D%3D
IC5-IC12 = 74LVC1G157GV-Q100H:74LVC1G157GV-Q100H: NXP - 74LVC1G157GV-Q100H - MUX, SINGLE, 2 I/P, SC-74-6 Source: Datasheet <https://assets.nexperia.com/documents/data-sheet/74LVC1G157_Q100.pdf>; DESCRIPTION: NXP - 74LVC1G157GV-Q100H - MUX, SINGLE, 2 I/P, SC-74-6; HEIGHT: 1.1mm; MANUFACTURER_NAME: Nexperia; MANUFACTURER_PART_NUMBER: 74LVC1G157GV-Q100H; MOUSER_PART_NUMBER: 771-74LVC1G157GVQ100; MOUSER_PRICE-STOCK: https://www.mouser.co.uk/ProductDetail/Nexperia/74LVC1G157GV-Q100H?qs=5XOdhvmYM0Nhlh6GR9ENlQ%3D%3D
IC13 IC15 IC21 IC22 IC24 IC26 = SamacSys_Parts:THS4221DBVTG4: High Speed Operational Amplifiers Low-Distortion High Speed R-to-R Output Source: Datasheet <https://www.ti.com/lit/ds/slos399g/slos399g.pdf>; DESCRIPTION: High Speed Operational Amplifiers Low-Distortion High Speed R-to-R Output; HEIGHT: 1.45mm; MANUFACTURER_NAME: Texas Instruments; MANUFACTURER_PART_NUMBER: THS4221DBVTG4; MOUSER_PART_NUMBER: 595-THS4221DBVTG4; MOUSER_PRICE-STOCK: https://www.mouser.co.uk/ProductDetail/Texas-Instruments/THS4221DBVTG4?qs=ZmJdcv7QZ9o2IikK4%252BsxYw%3D%3D
IC14 = 74xx-eu:74*151: Data SELECTOR/MULTIPLEXER
IC16 = 74LVT08D_118:74LVT08D,118: 74LVT08 - 3.3 V Quad 2-input AND gate@en-us Source: Datasheet <https://assets.nexperia.com/documents/data-sheet/74LVT08.pdf>; DESCRIPTION: 74LVT08 - 3.3 V Quad 2-input AND gate@en-us; HEIGHT: 1.75mm; MANUFACTURER_NAME: Nexperia; MANUFACTURER_PART_NUMBER: 74LVT08D,118; MOUSER_PART_NUMBER: 771-74LVT08D-T; MOUSER_PRICE-STOCK: https://www.mouser.com/Search/Refine.aspx?Keyword=771-74LVT08D-T
IC17 = 74xx-eu:74*590: 8-bit binary COUNTER, output register
IC18 IC19 = 74HC4040PW_118:74HC4040PW,118: 74HC(T)4040 - 12-stage binary ripple counter@en-us Source: Datasheet <https://assets.nexperia.com/documents/data-sheet/74HC_HCT4040.pdf>; DESCRIPTION: 74HC(T)4040 - 12-stage binary ripple counter@en-us; HEIGHT: 1.1mm; MANUFACTURER_NAME: Nexperia; MANUFACTURER_PART_NUMBER: 74HC4040PW,118; MOUSER_PART_NUMBER: 771-74HC4040PW-T; MOUSER_PRICE-STOCK: https://www.mouser.co.uk/ProductDetail/Nexperia/74HC4040PW118?qs=P62ublwmbi%252BHJ8m0Che0hA%3D%3D
JP1 JP3-JP64 = pinhead:PINHD-1X1: PIN HEADER
JP65 = pinhead:PINHD-2X7: PIN HEADER
LED6 = adafruit:LED: LED OSRAM: - CHIPLED LG R971, LG N971, LY N971, LG Q971, LY Q971, LO R971, LY R971 LH N974, LH R974 LS Q976, LO Q976, LY Q976 LO Q996 - Hyper CHIPLED LW Q18S LB Q993, LB Q99A, LB R99A - SideLED LS A670, LO A670, LY A670, LG A670, LP A670 LB A673, LV A673, LT A673, LW A673 LH A674 LY A675 LS A676, LA A676, LO A676, LY A676, LW A676 LS A679, LY A679, LG A679 - Hyper Micro SIDELED® LS Y876, LA Y876, LO Y876, LY Y876 LT Y87S - SmartLED LW L88C, LW L88S LB L89C, LB L89S, LG L890 LS L89K, LO L89K, LY L89K LS L896, LA L896, LO L896, LY L896 - TOPLED LS T670, LO T670, LY T670, LG T670, LP T670 LSG T670, LSP T670, LSY T670, LOP T670, LYG T670 LG T671, LOG T671, LSG T671 LB T673, LV T673, LT T673, LW T673 LH T674 LS T676, LA T676, LO T676, LY T676, LB T676, LH T676, LSB T676, LW T676 LB T67C, LV T67C, LT T67C, LS T67K, LO T67K, LY T67K, LW E67C LS E67B, LA E67B, LO E67B, LY E67B, LB E67C, LV E67C, LT E67C LW T67C LS T679, LY T679, LG T679 LS T770, LO T770, LY T770, LG T770, LP T770 LB T773, LV T773, LT T773, LW T773 LH T774 LS E675, LA E675, LY E675, LS T675 LS T776, LA T776, LO T776, LY T776, LB T776 LHGB T686 LT T68C, LB T68C - Hyper Mini TOPLED® LB M676 - Mini TOPLED Santana® LG M470 LS M47K, LO M47K, LY M47K Source: http://www.osram.convergy.de/
MP1-MP4 = PCB-Fasteners_Hardware:STANDOFF_F/F: Female-Female Standoff/Spacer with Mounting pad and hole. Essentra : Female Standoff <https://www.essentracomponents.co.in/index.php?option=com_virtuemart&view=productdetails&virtuemart_product_id=14493> The hole and pad sizes may vary based on the application and type of hardware; always verify the Manufacturer specification or Global Standards.; CATEGORY: Standoff/Spacer; SUB-CATEGORY: Female-Female
P-FET2 = microbuilder:MOSFET-P: P-Channel Mosfet LEGEND VDS: Voltage Drain-Source ID: Drain Current RDS(ON): Drain-Source On-State Resistance VGS(TH): Gate-Source Threshold Voltage CISS: Drain-Source Input Capacitance SOT-23 Name VDS ID RDS(ON) VGS(TH) CISS Order Number IRLML5103 30V 760mA 600 mOhm -- 75pF @ 25V Digikey: IRLML5103PBFCT-ND IRLML6401 12V 4.3A 50 mOhm 950mV @ 250µA 830pF @ 10V Digikey: IRLML6401PBFTR-ND NTR0202PL 20V 400mA 800 mOhm 2.3V @ 250uA 70pF @ 5V Digikey: NTR0202PLT1GOSTR-ND NTR4101PT1G 20V 1.8A 85 mOhm 1.2V @ 250uA 675pF @ 10V Digikey: NTR4101PT1GOSCT-ND DMP2004K 20V 600mA 900 mOhm 1V @ 250uA 175pF @ 16V Digikey: DMP2004KDICT-ND PMV65XP 20V 3.9A 76 mOhm 950mV @ 1mA 725pF @ 20V Digikey: 568-2358-2-ND TO-252 Name VDS ID RDS(ON) VGS(TH) CISS Order Number AOD417 30V 25A 34 mOhm 3V @ 250µA 920pF @ 15V Digikey: 785-1106-2-ND
S1 = ADG888YRUZ-REEL7:ADG888YRUZ-REEL7: Analog Switch Dual DPDT Automotive 16-Pin TSSOP T/R Source: Datasheet <https://www.analog.com/media/en/technical-documentation/data-sheets/ADG888.pdf>; DESCRIPTION: Analog Switch Dual DPDT Automotive 16-Pin TSSOP T/R; HEIGHT: 1.2mm; MANUFACTURER_NAME: Analog Devices; MANUFACTURER_PART_NUMBER: ADG888YRUZ-REEL7; MOUSER_PART_NUMBER: 584-ADG888YRUZ-R7; MOUSER_PRICE-STOCK: https://www.mouser.co.uk/ProductDetail/Analog-Devices/ADG888YRUZ-REEL7?qs=BpaRKvA4VqEo2e7kalqOsw%3D%3D
U1 = 74AHCT1G04SE-7:74AHCT1G04SE-7: DiodesZetex 74AHCT1G04SE-7 Inverter, Totem Pole, 4.5 5.5 V, 5-Pin SOT-353 Source: Datasheet <https://componentsearchengine.com/Datasheets/2/74AHCT1G04SE-7.pdf>; DESCRIPTION: DiodesZetex 74AHCT1G04SE-7 Inverter, Totem Pole, 4.5 5.5 V, 5-Pin SOT-353; HEIGHT: 1.1mm; MANUFACTURER_NAME: Diodes Inc.; MANUFACTURER_PART_NUMBER: 74AHCT1G04SE-7; MOUSER_PART_NUMBER: 621-74AHCT1G04SE-7; MOUSER_PRICE-STOCK: https://www.mouser.co.uk/ProductDetail/Diodes-Incorporated/74AHCT1G04SE-7?qs=MKoP7Oyr0W46emPhmpXrVg%3D%3D
U$1 = SparkFun-Retired:DB15: DB15 / VGA right angle through-hole female connector.
U$2 = USBC6P:USBC-6P: AliExpress Special! Connect 5.1k 10% resistors to each CC pin, pulled up to 3.3v or 5.0v.
VR1 VR2 VR4-VR7 = PTV09A-3015F-B103:PTV09A-3015F-B103: Potentiometers PANEL CONTROL - 9MM-ST-CARBON 10 kohms 15 mm Source: Datasheet <https://www.bourns.com/docs/Product-Datasheets/PTV09.pdf>; DESCRIPTION: Potentiometers PANEL CONTROL - 9MM-ST-CARBON 10 kohms 15 mm; HEIGHT: 12mm; MANUFACTURER_NAME: Bourns; MANUFACTURER_PART_NUMBER: PTV09A-3015F-B103; MOUSER_PART_NUMBER: 652-PTV09A-3015FB103; MOUSER_PRICE-STOCK: https://www.mouser.co.uk/ProductDetail/Bourns/PTV09A-3015F-B103?qs=5aG0NVq1C4zLnnFa8osaDg%3D%3D
Y1 = LFSPXO019137Reel:LFSPXO019137REEL: Standard Clock Oscillators 40.0MHz 7.0 x 5.0 x 1.4mm Source: Datasheet <https://componentsearchengine.com/Datasheets/1/LFSPXO019137Reel.pdf>; DESCRIPTION: Standard Clock Oscillators 40.0MHz 7.0 x 5.0 x 1.4mm; HEIGHT: 1.4mm; MANUFACTURER_NAME: IQD; MANUFACTURER_PART_NUMBER: LFSPXO019137Reel; MOUSER_PART_NUMBER: 449-LFSPXO019137REEL; MOUSER_PRICE-STOCK: https://www.mouser.com/Search/Refine.aspx?Keyword=449-LFSPXO019137REEL